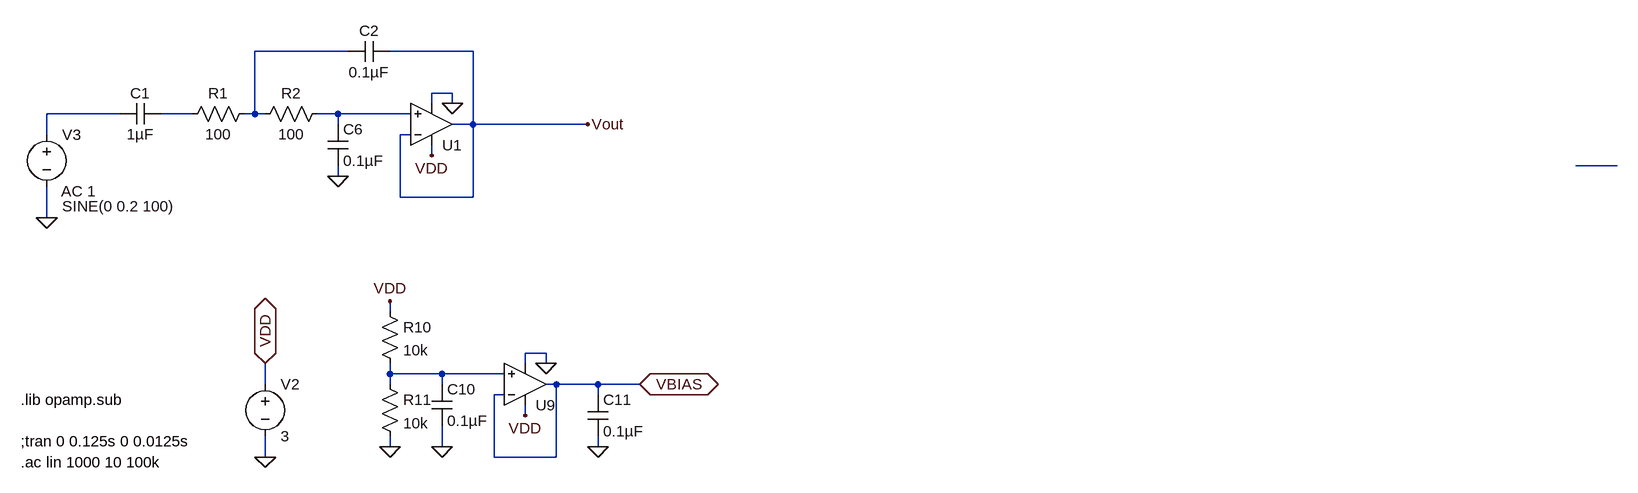
[diagram p0: schematic sallen-keyinputlowpassfilter.asc]
sallen-keyinputlowpassfilter.asc, the LTspice schematic file:
Version 4
SHEET 1 3412 1004
WIRE 400 176 256 176
WIRE 592 176 464 176
WIRE 560 240 528 240
WIRE 528 256 528 240
WIRE 560 256 560 240
WIRE 48 272 -64 272
WIRE 160 272 112 272
WIRE 256 272 256 176
WIRE 256 272 240 272
WIRE 272 272 256 272
WIRE 384 272 352 272
WIRE 496 272 384 272
WIRE 384 288 384 272
WIRE 592 288 592 176
WIRE 592 288 560 288
WIRE 768 288 592 288
WIRE -64 304 -64 272
WIRE 496 304 480 304
WIRE 528 336 528 320
WIRE 2352 352 2288 352
WIRE 384 368 384 352
WIRE 480 400 480 304
WIRE 592 400 592 288
WIRE 592 400 480 400
WIRE -64 432 -64 384
WIRE 464 576 464 560
WIRE 704 640 672 640
WIRE 672 656 672 640
WIRE 704 656 704 640
WIRE 464 672 464 656
WIRE 544 672 464 672
WIRE 640 672 544 672
WIRE 272 688 272 656
WIRE 464 688 464 672
WIRE 544 688 544 672
WIRE 720 688 704 688
WIRE 784 688 720 688
WIRE 848 688 784 688
WIRE 640 704 624 704
WIRE 784 704 784 688
WIRE 672 736 672 720
WIRE 464 784 464 768
WIRE 544 784 544 752
WIRE 784 784 784 768
WIRE 272 800 272 768
WIRE 624 800 624 704
WIRE 720 800 720 688
WIRE 720 800 624 800
FLAG 272 800 0
FLAG 272 656 VDD
IOPIN 272 656 BiDir
FLAG 464 784 0
FLAG 544 784 0
FLAG 464 560 VDD
FLAG 784 784 0
FLAG 848 688 VBIAS
IOPIN 848 688 BiDir
FLAG 704 656 0
FLAG 672 736 VDD
FLAG 384 368 0
FLAG 560 256 0
FLAG 528 336 VDD
FLAG -64 432 0
FLAG 768 288 Vout
SYMBOL voltage 272 672 R0
WINDOW 123 0 0 Left 0
WINDOW 39 0 0 Left 0
SYMATTR InstName V2
SYMATTR Value 3
SYMBOL Opamps\\UniversalOpamp2 672 688 M180
SYMATTR InstName U9
SYMBOL Opamps\\UniversalOpamp2 528 288 M180
SYMATTR InstName U1
SYMBOL voltage -64 288 R0
WINDOW 3 24 126 Left 0
WINDOW 123 22 103 Left 0
WINDOW 39 0 0 Left 0
SYMATTR Value SINE(0 0.2 100)
SYMATTR Value2 AC 1
SYMATTR InstName V3
SYMBOL cap 48 288 R270
WINDOW 0 32 32 VTop 0
WINDOW 3 0 32 VBottom 0
SYMATTR InstName C1
SYMATTR Value 1µF
SYMBOL cap 400 192 R270
WINDOW 0 32 32 VTop 0
WINDOW 3 0 32 VBottom 0
SYMATTR InstName C2
SYMATTR Value 0.1µF
SYMBOL cap 368 288 R0
SYMATTR InstName C6
SYMATTR Value 0.1µF
SYMBOL cap 528 688 R0
SYMATTR InstName C10
SYMATTR Value 0.1µF
SYMBOL cap 768 704 R0
SYMATTR InstName C11
SYMATTR Value 0.1µF
SYMBOL res 144 288 R270
WINDOW 0 32 56 VTop 0
WINDOW 3 0 56 VBottom 0
SYMATTR InstName R1
SYMATTR Value 100
SYMBOL res 256 288 R270
WINDOW 0 32 56 VTop 0
WINDOW 3 0 56 VBottom 0
SYMATTR InstName R2
SYMATTR Value 100
SYMBOL res 448 560 R0
SYMATTR InstName R10
SYMATTR Value 10k
SYMBOL res 448 672 R0
SYMATTR InstName R11
SYMATTR Value 10k
TEXT -104 776 Left 0 !;tran 0 0.125s 0 0.0125s
TEXT -104 712 Left 0 !.lib opamp.sub
TEXT -104 808 Left 0 !.ac lin 1000 10 100k

The netlist it stands for:
* sallen-keyinputlowpassfilter.asc
V2 VDD 0 3
XU9 N006 VBIAS VDD 0 VBIAS level.2 Avol=1Meg GBW=10Meg Slew=10Meg ilimit=25m rail=0 Vos=0 phimargin=45 en=0 enk=0 in=0 ink=0 Rin=500Meg  ; pins IN+ IN- V+ V- OUT
XU1 N004 Vout VDD 0 Vout level.2 Avol=1Meg GBW=10Meg Slew=10Meg ilimit=25m rail=0 Vos=0 phimargin=45 en=0 enk=0 in=0 ink=0 Rin=500Meg  ; pins IN+ IN- V+ V- OUT
V3 N002 0 SINE(0 0.2 100) AC 1
C1 N002 N003 1µF
C2 N001 Vout 0.1µF
C6 N004 0 0.1µF
C10 N006 0 0.1µF
C11 VBIAS 0 0.1µF
R1 N003 N001 100
R2 N001 N004 100
R10 VDD N006 10k
R11 N006 0 10k
;tran 0 0.125s 0 0.0125s
.lib opamp.sub
.ac lin 1000 10 100k
.lib UniversalOpamps2.sub
.backanno
.end